# EAGLE design bias-t (EAGLE 7.7.0)
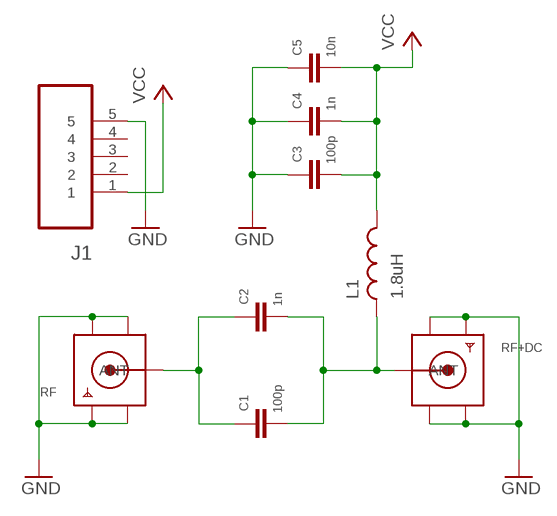
[diagram p0: schematic, sheet 1]

## Parts
C1  100p  0805CAP  [0805]
C2  1n  0805CAP  [0805]
C3  100p  0805CAP  [0805]
C4  1n  0805CAP  [0805]
C5  10n  0805CAP  [0805]
J1  47346-0001  [MOLEX_47346-0001]
L1  1.8uH  1008INDUCTOR  [1008INDUCTOR]
RF  SMACONNECTOR_EDGE  [SMA_EDGELAUNCH]
RF+DC  SMACONNECTOR_EDGE  [SMA_EDGELAUNCH]

## Nets
GND: C3.P$2 C4.P$2 C5.P$2 J1.5 RF+DC.GND@1(GND4) RF+DC.GND@2(GND3) RF+DC.GND@3(GND2) RF+DC.GND@4(GND1) RF.GND@1(GND4) RF.GND@2(GND3) RF.GND@3(GND2) RF.GND@4(GND1)
N$1 [RF]: C1.P$2 C2.P$2 RF.P(ANT)
N$2 [RF]: C1.P$1 C2.P$1 L1.P$1 RF+DC.P(ANT)
VCC: C3.P$1 C4.P$1 C5.P$1 J1.1 L1.P$2
Unconnected: J1.2 J1.3 J1.4

## Library data of the parts
C1-C5 = Samsung-Passives:0805CAP
J1 = Molex-47346-0001:47346-0001: CONN RCPT 5POS MICRO USB R/A SMD; MPN: 47346-0001; OC_FARNELL: 1568026; OC_NEWARK: 47M0505; PACKAGE: 5 POS MICRO USB R/A; SUPPLIER: MOLEX
L1 = FerroCore:1008INDUCTOR
RF RF+DC = adafruit:SMACONNECTOR: SMA Connector 90° DIP SMA Connector, 50 Ohm (4UConnector: 07259)

## Net classes
1 RF: width 1.016 mm, clearance 0.508 mm

## Board
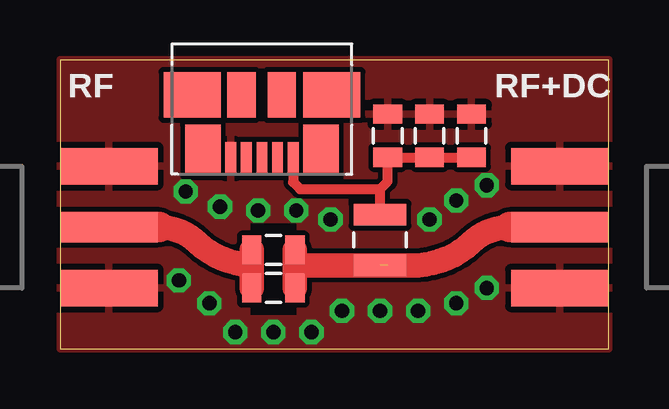
[diagram p1: board, top side]
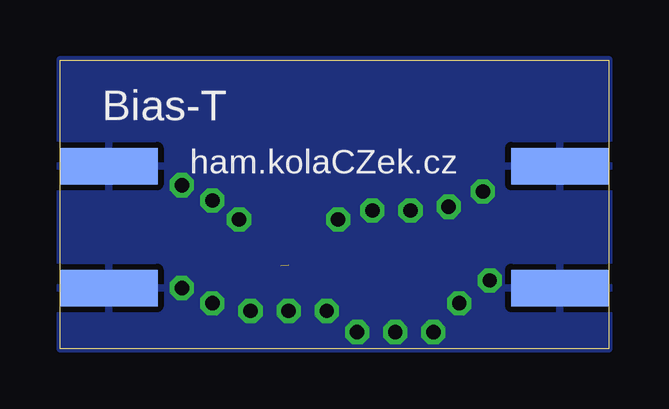
[diagram p2: board, bottom side, seen from below]

Size 22.86 x 12.05 mm. Coordinates in mm from the lower left corner, seen from the top.
Outline: 0,0 22.86,0 22.86,12.05 0,12.05 0,0
Copper layers (1*16): Top 0.035mm / dielectric 1.5mm / Bottom 0.035mm
Design rules "default *": minimum track width 10mil, minimum drill 24mil, track to track 8mil, track to pad 8mil, pad to pad 8mil, via to via 8mil, smd to smd 8mil, copper to edge 0mil, drill to drill 8mil, minimum pad ring 10mil, minimum via ring 8mil, stop-mask expansion 4mil, vias tented up to drill 100mil, thermal gap 10mil

### Footprints (pad centres in the part's own frame; a part is rotated, then mirrored left to right if it is on the bottom)
0805 = smd 0.8 x 1.2: P$1 -0.9,0; P$2 0.9,0
MOLEX_47346-0001 = smd 0.45 x 1.38: 1 -1.3,0; 2 -0.65,0; 3 0,0; 4 0.65,0; 5 1.3,0 | smd 1.475 x 2.1: M1 -2.462,-0.36; M2 2.462,-0.36 | smd 2.375 x 1.9: M3 -2.913,-2.66; M6 2.913,-2.66 | smd 1.175 x 1.9: M4 -0.82,-2.66; M5 0.85,-2.66
1008INDUCTOR = smd 0.9 x 2.2: P$1 -1.05,0; P$2 1.05,0
SMA_EDGELAUNCH = smd 4.064 x 1.524: GND@1 2.032,-2.54; GND@2 2.032,2.54 | smd 4.064 x 1.524 bottom: GND@3 2.032,2.54; GND@4 2.032,-2.54 | smd 4.064 x 1.27: P 2.032,0

### Placement (x,y rotation side)
C1  8.89,4.13 180 top
C2  8.89,2.54 180 top
C3  13.65,8.89 90 top
C4  15.4,8.89 90 top
C5  17.14,8.89 90 top
J1  8.41,7.94 180 top
L1  13.34,4.55 90 top
RF  0,5.08 0 top
RF+DC  22.86,5.08 180 top

### Tracks (layer width: path | path; a pad name or v marks a point on that pad's centre or on a via)
GND  (via drill 0.6)
  other vias: 4.95,2.86 7.3,0.7 8.89,0.7 10.48,0.7 11.75,1.59 9.84,5.77 8.26,5.77 16.51,6.19 13.34,1.59 14.92,1.59 6.22,1.91 17.78,2.54 16.51,1.91 6.67,5.93 15.4,5.4 11.27,5.4 17.78,6.83 5.24,6.57
  pour Top: 0,12.06 22.86,12.06 22.86,0 0,0
  pour Bottom: 0,12.06 22.86,12.06 22.86,0 0,0
N$1
  Top 1.016: 4.13,5.08 arc-44 5.71,4.45 arc41 7.94,3.49 | 7.94,3.49 7.99,3.49 C2.P$2 | C1.P$2 7.99,3.54 7.94,3.49
  Top 1.27: 4.13,5.08 RF.P
N$2  (1 unrouted)
  Top 0: 13.65,3.51 13.65,3.49
  Top 1.016: 18.73,5.08 arc44 17.14,4.45 arc-41 14.92,3.49 13.65,3.49 9.79,3.49 | 9.79,3.49 C1.P$1 | C2.P$1 9.79,3.49
  Top 1.27: 18.73,5.08 RF+DC.P
N$3
  cutout Top: 7.94,5.23 9.84,5.23 9.84,1.42 7.94,1.42
VCC
  Top 0.406: C5.P$1 C4.P$1 C3.P$1 13.65,6.99 13.34,6.67 | J1.1 9.71,6.96 10,6.67 13.34,6.67 | L1.P$2 13.34,6.67

### Text on the board
bNames: Bias-T | ham.kolaCZek.cz